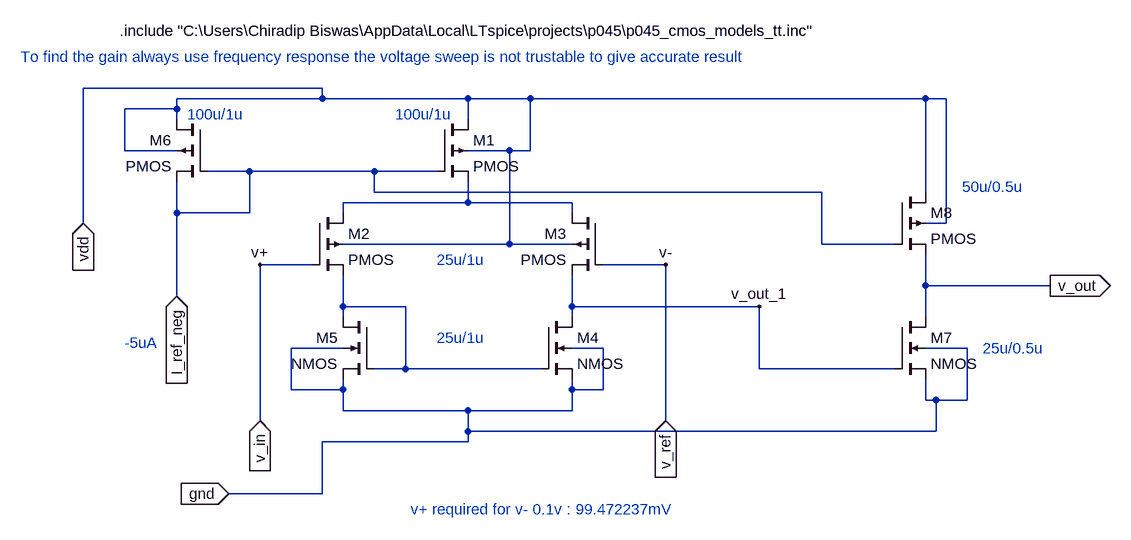
[diagram p0: schematic static_comparator_pmosbased_ckt.asc]
static_comparator_pmosbased_ckt.asc, the LTspice schematic file:
Version 4
SHEET 1 1308 712
WIRE 64 0 -304 0
WIRE 64 16 64 0
WIRE 64 16 -160 16
WIRE 288 16 64 16
WIRE 384 16 288 16
WIRE 992 16 384 16
WIRE 1024 16 992 16
WIRE -160 32 -160 16
WIRE -160 32 -240 32
WIRE -160 48 -160 32
WIRE 288 48 288 16
WIRE -240 96 -240 32
WIRE -160 96 -240 96
WIRE 352 96 288 96
WIRE 384 96 384 16
WIRE 384 96 352 96
WIRE -48 128 -112 128
WIRE 144 128 -48 128
WIRE 240 128 144 128
WIRE 144 160 144 128
WIRE 832 160 144 160
WIRE 992 160 992 16
WIRE 288 176 288 144
WIRE 288 176 96 176
WIRE 448 176 288 176
WIRE -160 192 -160 144
WIRE -48 192 -48 128
WIRE -48 192 -160 192
WIRE 96 192 96 176
WIRE 448 192 448 176
WIRE -304 208 -304 0
WIRE 1024 208 1024 16
WIRE 1024 208 992 208
WIRE 352 240 352 96
WIRE 352 240 96 240
WIRE 448 240 352 240
WIRE 832 240 832 160
WIRE 944 240 832 240
WIRE 48 272 -32 272
WIRE 592 272 496 272
WIRE 992 304 992 256
WIRE 1184 304 992 304
WIRE -160 320 -160 192
WIRE 96 336 96 288
WIRE 192 336 96 336
WIRE 448 336 448 288
WIRE 736 336 448 336
WIRE 96 352 96 336
WIRE 448 352 448 336
WIRE 992 352 992 304
WIRE 96 400 16 400
WIRE 496 400 448 400
WIRE 1056 400 992 400
WIRE 192 432 192 336
WIRE 192 432 144 432
WIRE 400 432 192 432
WIRE 736 432 736 336
WIRE 944 432 736 432
WIRE 16 464 16 400
WIRE 96 464 96 448
WIRE 96 464 16 464
WIRE 448 464 448 448
WIRE 496 464 496 400
WIRE 496 464 448 464
WIRE 992 480 992 448
WIRE 1008 480 992 480
WIRE 1056 480 1056 400
WIRE 1056 480 1008 480
WIRE 96 496 96 464
WIRE 288 496 96 496
WIRE 448 496 448 464
WIRE 448 496 288 496
WIRE -32 512 -32 272
WIRE 592 512 592 272
WIRE 288 528 288 496
WIRE 1008 528 1008 480
WIRE 1008 528 288 528
WIRE 288 544 288 528
WIRE 288 544 64 544
WIRE 64 624 64 544
WIRE 64 624 -80 624
FLAG 736 336 v_out_1
FLAG 592 272 v-
FLAG -32 272 v+
FLAG 1184 304 v_out
IOPIN 1184 304 Out
FLAG 592 512 v_ref
IOPIN 592 512 In
FLAG -32 512 v_in
IOPIN -32 512 In
FLAG -160 320 I_ref_neg
IOPIN -160 320 In
FLAG -304 208 vdd
IOPIN -304 208 In
FLAG -80 624 gnd
IOPIN -80 624 In
SYMBOL pmos4 240 48 R0
SYMATTR InstName M1
SYMATTR Value2 l=1u w=100u
SYMBOL pmos4 48 192 R0
SYMATTR InstName M2
SYMATTR Value2 l=1u w=25u
SYMBOL pmos4 496 192 M0
SYMATTR InstName M3
SYMATTR Value2 l=1u w=25u
SYMBOL nmos4 400 352 R0
SYMATTR InstName M4
SYMATTR Value2 l=1u w=25u
SYMBOL nmos4 144 352 M0
SYMATTR InstName M5
SYMATTR Value2 l=1u w=25u
SYMBOL pmos4 -112 48 M0
SYMATTR InstName M6
SYMATTR Value2 l=1u w=100u
SYMBOL nmos4 944 352 R0
SYMATTR InstName M7
SYMATTR Value2 l=0.5u w=25u
SYMBOL pmos4 944 160 R0
SYMATTR InstName M8
SYMATTR Value2 l=0.5u w=50u
TEXT -248 -88 Left 2 !.include "C:\\Users\\Chiradip Biswas\\AppData\\Local\\LTspice\\projects\\p045\\p045_cmos_models_tt.inc"
TEXT -400 -48 Left 2 ;To find the gain always use frequency response the voltage sweep is not trustable to give accurate result
TEXT 240 264 Left 2 ;25u/1u
TEXT 176 40 Left 2 ;100u/1u
TEXT -144 40 Left 2 ;100u/1u
TEXT 240 384 Left 2 ;25u/1u
TEXT 1048 152 Left 2 ;50u/0.5u
TEXT 1080 400 Left 2 ;25u/0.5u
TEXT 200 648 Left 2 ;v+ required for v- 0.1v : 99.472237mV
TEXT -240 392 Left 2 ;-5uA

The netlist it stands for:
* static_comparator_pmosbased_ckt.asc
M1 vdd I_ref_neg N001 vdd PMOS l=1u w=100u
M2 N001 v_in N002 vdd PMOS l=1u w=25u
M3 N001 v_ref v_out_1 vdd PMOS l=1u w=25u
M4 v_out_1 N002 gnd gnd NMOS l=1u w=25u
M5 N002 N002 gnd gnd NMOS l=1u w=25u
M6 vdd I_ref_neg I_ref_neg vdd PMOS l=1u w=100u
M7 v_out v_out_1 gnd gnd NMOS l=0.5u w=25u
M8 vdd I_ref_neg v_out vdd PMOS l=0.5u w=50u
.model NMOS NMOS
.model PMOS PMOS
.lib standard.mos
.include "C:\Users\Chiradip Biswas\AppData\Local\LTspice\projects\p045\p045_cmos_models_tt.inc"
* To find the gain always use frequency response the voltage sweep is not trustable to give accurate result
* 25u/1u
* 100u/1u
* 100u/1u
* 25u/1u
* 50u/0.5u
* 25u/0.5u
* v+ required for v- 0.1v : 99.472237mV
* -5uA
.backanno
.end